# EasyEDA Pro project TC358870 HDMI2MIPI.epro, schematic Schematic2
Board Name: connector; Create Date: 2024-10-12; Page Name: P1; Project Name: tc358870 HDMI转MIPI; Schematic Name: Schematic2; Update Date: 2025-04-06; Company: 嘉立创EDA; Page Size: A3; Version: V1.0
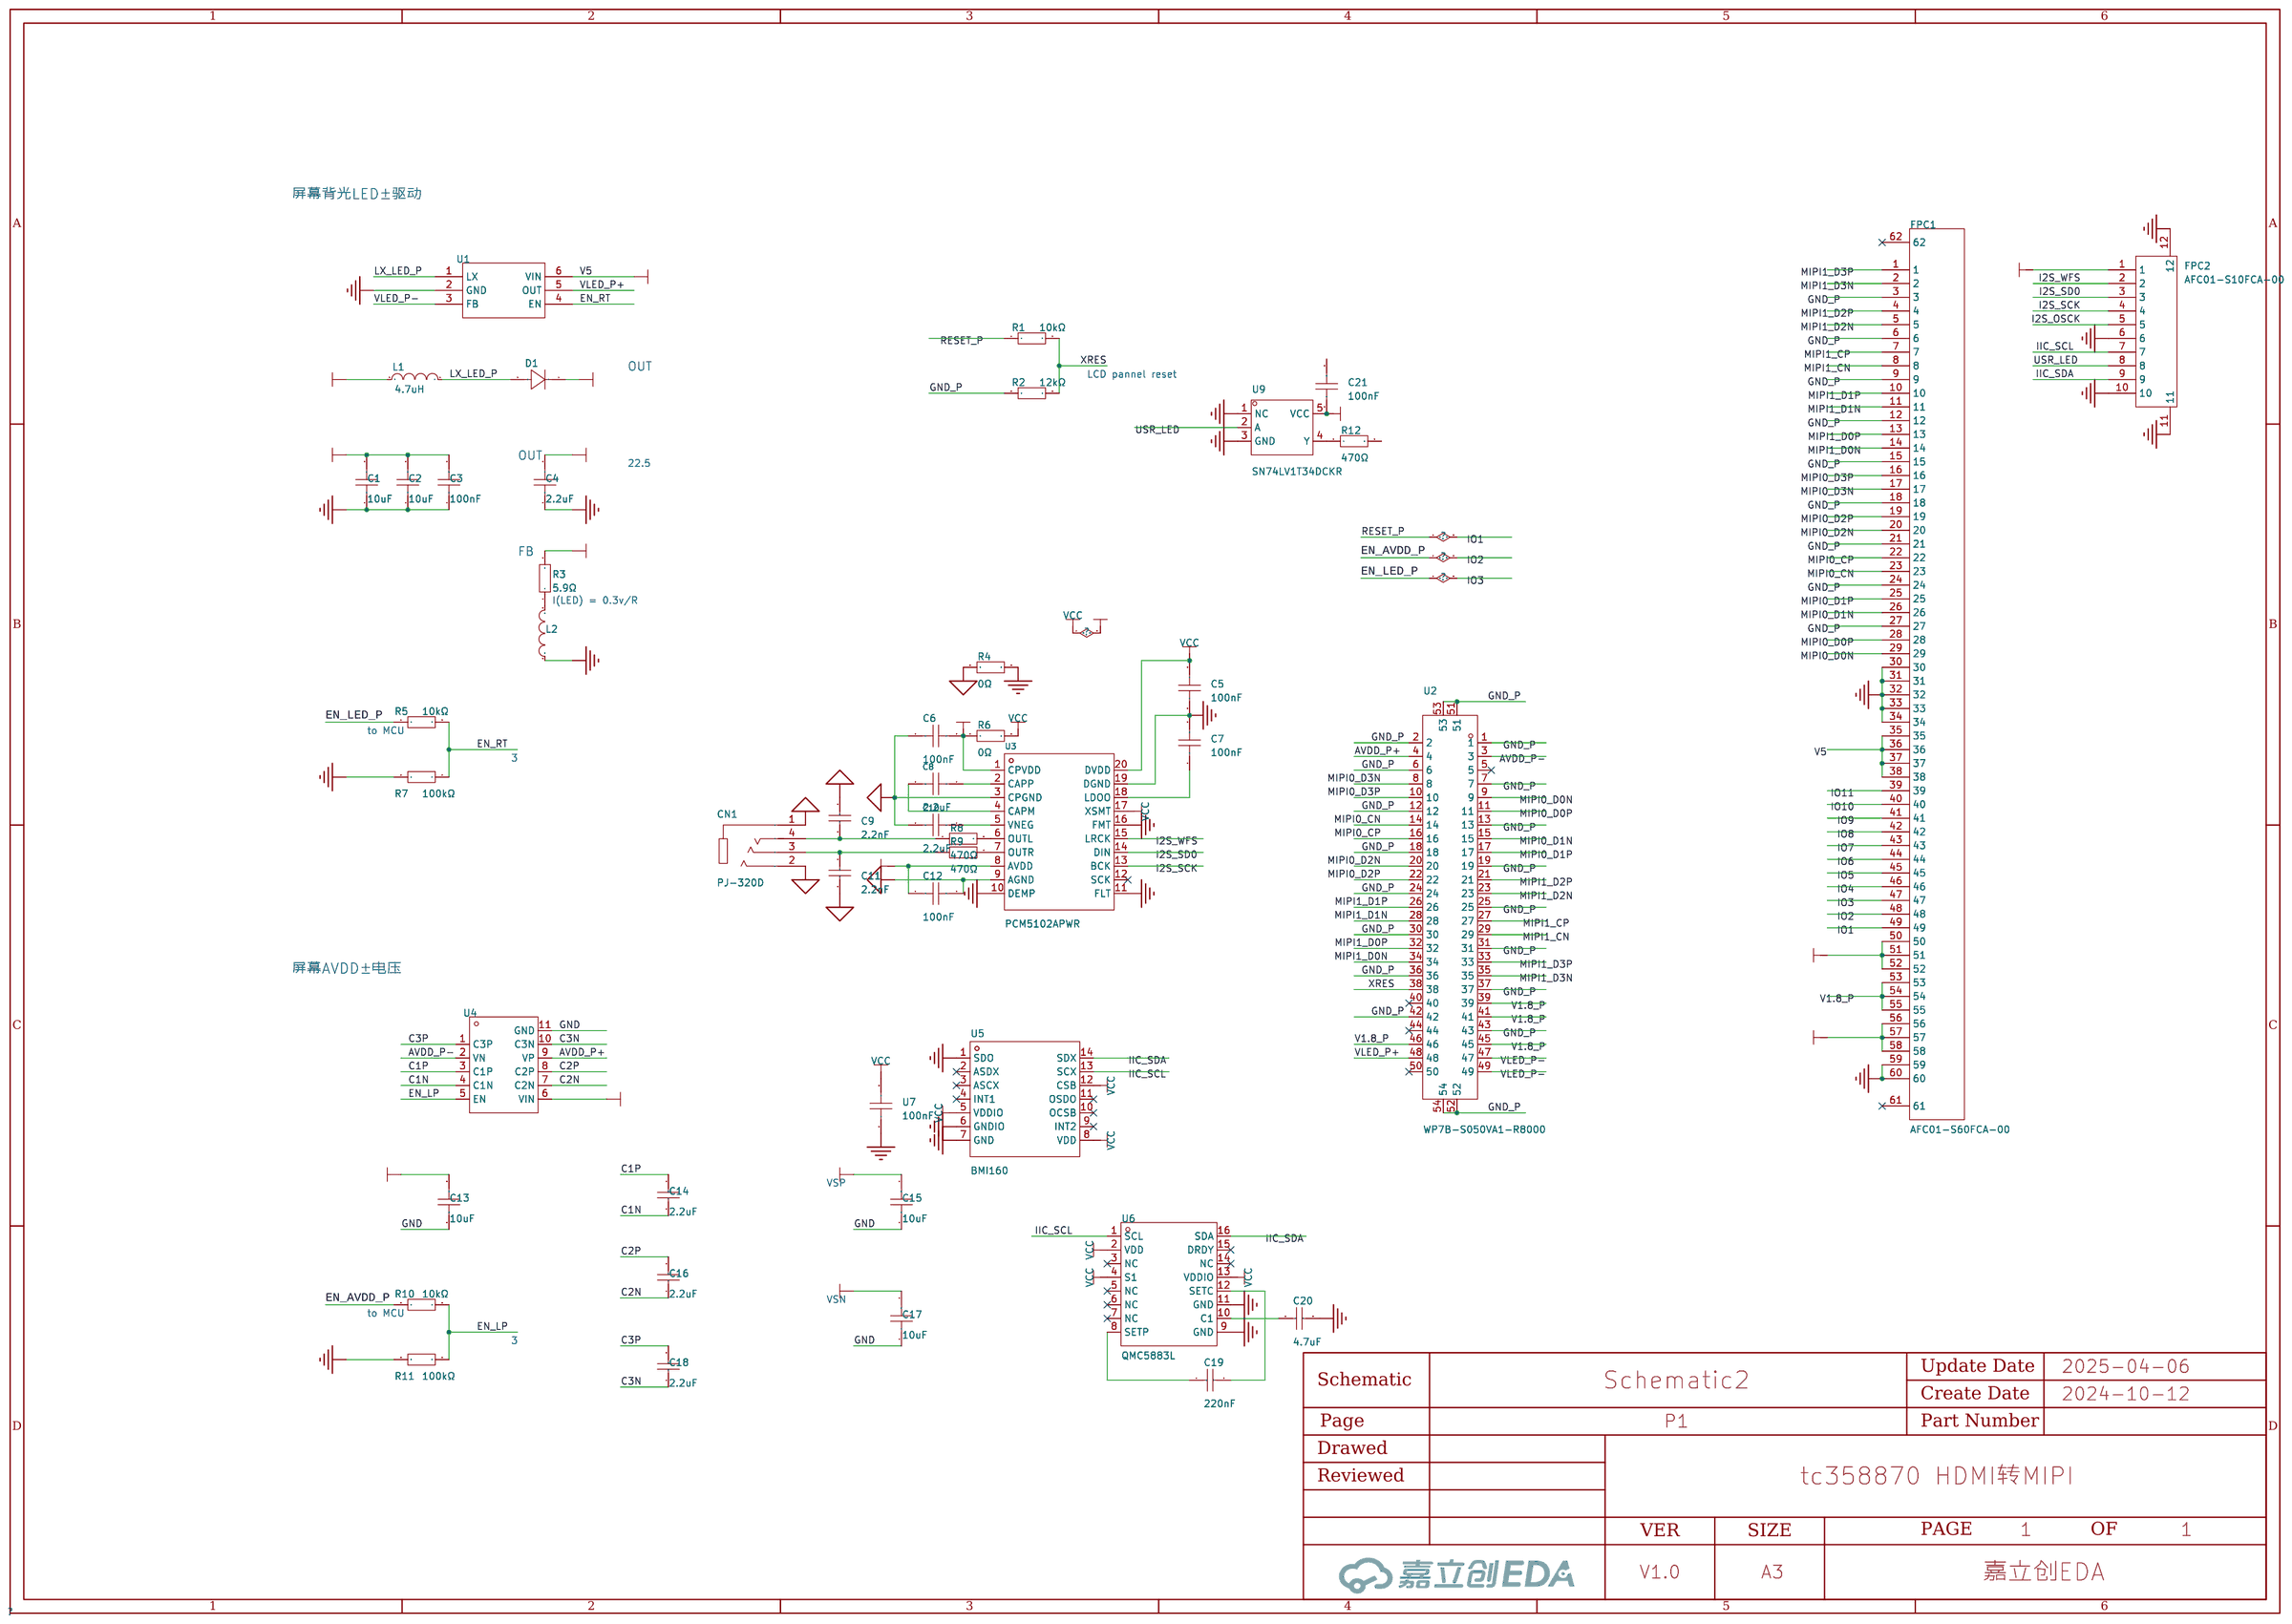
[diagram p1: schematic sheet]

## Parts
C1  10uF  [C0603]
C2  10uF  [C0603]
C3  100nF  [C0603]
C4  2.2uF  [C0603]
C5  100nF  [C0603]
C6  100nF  [C0603]
C7  100nF  [C0603]
C8  2.2uF  [C0603]
C9  2.2nF  [C0603]
C10  2.2uF  [C0603]
C11  2.2nF  [C0603]
C12  100nF  [C0603]
C13  10uF  [C0603]
C14  2.2uF  [C0603]
C15  10uF  [C0603]
C16  2.2uF  [C0603]
C17  10uF  [C0603]
C18  2.2uF  [C0603]
C19  220nF  [C0603]
C20  4.7uF  [C0603]
C21  100nF  [C0603]
CN1  PJ-320D  [AUDIO-SMD_PJ-320D]
D1  SS36FA  [SOD-123FL_L2.8-W1.8-LS3.6-RD]
FPC1  AFC01-S60FCA-00  [FPC-SMD_AFC01-S60FCC-00]
FPC2  AFC01-S10FCA-00  [FPC-SMD_P0.5-10P_FGS-XJ-H2.0]
L1  4.7uH  [IND-SMD_L4.4-W4.2]
L2  CBG201209U121T  [L0805]
R1  10kΩ  [R0603]
R2  12kΩ  [R0603]
R3  5.9Ω  [R0805]
R4  0Ω  [R0603]
R5  10kΩ  [R0603]
R6  0Ω  [R0603]
R7  100kΩ  [R0603]
R8  470Ω  [R0603]
R9  470Ω  [R0603]
R10  10kΩ  [R0603]
R11  100kΩ  [R0603]
R12  470Ω  [R0603]
U1  RT9293BGJ6  [SOT-23-6_L2.9-W1.6-P0.95-LS2.8-BR]
U2  WP7B-S050VA1-R8000  [CONN-SMD_WP7B-S050VA1-R8000]
U3  PCM5102APWR  [TSSOP-20_L6.5-W4.4-P0.65-LS6.4-BL]
U4  LP3102QVF  [TDFN-10_L3.0-W3.0-P0.50-BL-EP]
U5  BMI160  [LGA-14_L3.0-W2.5-P0.50-BL]
U6  QMC5883L  [LGA-16_L3.0-W3.0-P0.50-BL_SQ]
U7  100nF  [C0603]
U9  SN74LV1T34DCKR  [SC-70-5_L2.1-W1.3-P0.65-LS2.1-BR]

## Library data of the parts
C1 C2 C13 C15 C17 = CC0603MRX5R8BB106: 容值:10uF;精度:±20%;额定电压:25V;材质(温度系数):X5R;; LCSC Part Name: 10uF ±20% 25V; Supplier Part: C596327; Manufacturer: YAGEO(国巨); Supplier Footprint: 0603; JLCPCB Part Class: 扩展库; Datasheet: https://atta.szlcsc.com/upload/public/pdf/source/20200609/C596327_17DF31B1E9B32F0BAA34398C136F635E.pdf; Supplier: LCSC; Tolerance: ±20%; Voltage Rated: 25V; Temperature Coefficient: X5R
C3 C21 = CC0603KRX7R9BB104: 容值:100nF;精度:±10%;额定电压:50V;材质(温度系数):X7R;; LCSC Part Name: 100nF ±10% 50V; Supplier Part: C14663; Manufacturer: YAGEO(国巨); Supplier Footprint: 0603; JLCPCB Part Class: 基础库; Datasheet: https://atta.szlcsc.com/upload/public/pdf/source/20170116/1484561234239.pdf; Supplier: LCSC; Tolerance: ±10%; Voltage Rated: 50V; Temperature Coefficient: X7R
C4 C8 C10 = CL10A225KB8NNNC: 容值:2.2uF;精度:±10%;额定电压:50V;材质(温度系数):-;; LCSC Part Name: 2.2uF ±10% 50V; Supplier Part: C913904; Manufacturer: SAMSUNG(三星); Supplier Footprint: 0603; JLCPCB Part Class: 扩展库; Datasheet: https://atta.szlcsc.com/upload/public/pdf/source/20200102/C478861_C4302703595930F3C0E62DAD3349F1AA.pdf; Supplier: LCSC; Tolerance: ±10%; Voltage Rated: 50V
C5-C7 C12 U7 = CGA0603X7R104K500JT: 容值:100nF;精度:±10%;额定电压:50V;材质(温度系数):X7R;; LCSC Part Name: 100nF ±10% 50V; Supplier Part: C6119867; Manufacturer: HRE(芯声); Supplier Footprint: 0603; JLCPCB Part Class: 扩展库; Supplier: LCSC; Tolerance: ±10%; Voltage Rated: 50V; Temperature Coefficient: X7R
C9 C11 = 0603B222K500NT: 容值:2.2nF;精度:±10%;额定电压:50V;材质(温度系数):X7R;; LCSC Part Name: 2.2nF ±10% 50V; Supplier Part: C1604; Manufacturer: FH(风华); Supplier Footprint: 0603; JLCPCB Part Class: 基础库; Datasheet: https://atta.szlcsc.com/upload/public/pdf/source/20200305/C486355_26A10D38EF8C2A5C37091D0039909270.pdf; Supplier: LCSC; Tolerance: ±10%; Voltage Rated: 50V; Temperature Coefficient: X7R
C14 C16 C18 = CL10A225KO8NNNC: 容值:2.2uF;精度:±10%;额定电压:16V;材质(温度系数):X5R;; LCSC Part Name: 2.2uF ±10% 16V; Supplier Part: C23630; Manufacturer: SAMSUNG(三星); Supplier Footprint: 0603; JLCPCB Part Class: 基础库; Datasheet: https://atta.szlcsc.com/upload/public/pdf/source/20160103/1457707709512.pdf; Supplier: LCSC; Tolerance: ±10%; Voltage Rated: 16V; Temperature Coefficient: X5R
C19 = CL10B224KA8NNNC: 容值:220nF;精度:±10%;额定电压:25V;材质(温度系数):X7R;; LCSC Part Name: 220nF ±10% 25V; Supplier Part: C21120; Manufacturer: SAMSUNG(三星); Supplier Footprint: 0603; JLCPCB Part Class: 基础库; Datasheet: https://atta.szlcsc.com/upload/public/pdf/source/20160218/1457707763339.pdf; Supplier: LCSC; Tolerance: ±10%; Voltage Rated: 25V; Temperature Coefficient: X7R
C20 = CL10A475KO8NNNC: 容值:4.7uF;精度:±10%;额定电压:16V;材质(温度系数):X5R;; LCSC Part Name: 4.7uF ±10% 16V; Supplier Part: C19666; Manufacturer: SAMSUNG(三星); Supplier Footprint: 0603; JLCPCB Part Class: 基础库; Datasheet: https://atta.szlcsc.com/upload/public/pdf/source/20160218/1457707763339.pdf; Supplier: LCSC; Tolerance: ±10%; Voltage Rated: 16V; Temperature Coefficient: X5R
CN1 = PJ-320D_C431535: 连接器类型:3.5mm耳机座;额定电流:300mA;额定电压:50V;工作温度范围:-16℃~+65℃;; LCSC Part Name: 3.5mm耳机座; Supplier Part: C431535; Manufacturer: SHOU HAN(首韩); Supplier Footprint: SMD; JLCPCB Part Class: 扩展库; Datasheet: https://atta.szlcsc.com/upload/public/pdf/source/20190925/C431535_8B274506621F6117FB020BF07A197848.pdf; Supplier: LCSC; Connector Type: 3.5mm耳机座; Current Rating (Max): 300mA; Voltage Rating (Max): 50V; Operating Temperature Range: -16℃~+65℃
D1 = SS36FA: 二极管配置:独立式;直流反向耐压(Vr):60V;平均整流电流(Io):3A;正向压降(Vf):750mV@3A;反向电流(Ir):500uA@60V;; LCSC Part Name: 3 A、60 V 表面贴装肖特基势垒整流器; Supplier Part: C719835; Manufacturer: onsemi(安森美); Supplier Footprint: SOD-123FL; JLCPCB Part Class: 扩展库; Datasheet: https://atta.szlcsc.com/upload/public/pdf/source/20200807/C719828_012175D3E2CDD5FCD772096ACDE7B286.pdf; Supplier: LCSC; Diode Configuration: 独立式; Reverse Voltage (Vr): 60V; Average Rectified Current (Io): 3A; Forward Voltage (Vf@If): 750mV@3A; Reverse Leakage Current (Ir): 500uA@60V
FPC1 = AFC01-S60FCA-00: 锁定特性:翻盖式;触点类型:下接;触点数量:60P;间距:0.5mm;安装类型:卧贴;; LCSC Part Name: 间距:0.5mm P数:60P 翻盖式 下接; Supplier Part: C262678; Manufacturer: JS(钜硕电子); Supplier Footprint: SMD,P=0.5mm,卧贴; JLCPCB Part Class: 扩展库; Datasheet: https://atta.szlcsc.com/upload/public/pdf/source/20190726/C11047_78689421E6D6672DE8D11ECCF89B3729.pdf; Supplier: LCSC; Locking Feature: 翻盖式; Contact Type: 下接; Number of Contacts: 60P; Pitch: 0.5mm; Mounting Type: 卧贴; FFC, FCB Thickness: 0.3mm; Height Above Board: 2mm
FPC2 = AFC01-S10FCA-00: 锁定特性:翻盖式;触点类型:下接;触点数量:10P;间距:0.5mm;安装类型:卧贴;; LCSC Part Name: 间距:0.5mm P数:10P 翻盖式 下接; Supplier Part: C262659; Manufacturer: JS(钜硕电子); Supplier Footprint: SMD,P=0.5mm,卧贴; JLCPCB Part Class: 扩展库; Datasheet: https://atta.szlcsc.com/upload/public/pdf/source/20190816/C413942_2A72D1AC756EAE17EEDF756A339D4500.pdf; Supplier: LCSC; Locking Feature: 翻盖式; Contact Type: 下接; Number of Contacts: 10P; Pitch: 0.5mm; Mounting Type: 卧贴; FFC, FCB Thickness: 0.3mm; Height Above Board: 2mm
L1 = cjiang国产功率电感-4.7uH ±20% 3A 105mΩ: 电感值:4.7uH;精度:±20%;额定电流:3A;饱和电流(Isat):3A;直流电阻(DCR):105mΩ;; LCSC Part Name: 4.7uH ±20% 3A 105mΩ; Supplier Part: C3040385; Manufacturer: cjiang(长江微电); Manufacturer Part: FAUL0420-4R7MT; Supplier Footprint: SMD,4.4x4.2x1.8mm; JLCPCB Part Class: Extended Part; Datasheet: https://item.szlcsc.com/3597562.html; Supplier: LCSC; Tolerance: ±20%; Rated Current: 3A; Saturation Current (Isat): 3A; DC Resistance (DCR): 105mΩ
L2 = CBG201209U121T: 标称阻抗@测试频率:120Ω@100MHz;误差:±25%;直流电阻(RDC):200mΩ;额定电流:500mA;电路数:1;; LCSC Part Name: 120Ω@100MHz ±25%; Supplier Part: C41330; Manufacturer: FH(风华); Supplier Footprint: 0805; JLCPCB Part Class: 扩展库; Datasheet: https://atta.szlcsc.com/upload/public/pdf/source/20150124/1457707261288.pdf; Supplier: LCSC; Impedance @ Frequency: 120Ω@100MHz; Tolerance: ±25%; DC Resistance: 200mΩ; Current Rating: 500mA; Circuits: 1
R1 R5 R10 = 0603WAF1002T5E: 电阻类型:厚膜电阻;阻值:10kΩ;精度:±1%;功率:100mW;温度系数:±100ppm/℃;最大工作电压:75V;工作温度范围:-55℃~+155℃;; LCSC Part Name: 10kΩ ±1% 100mW; Supplier Part: C25804; Manufacturer: UNI-ROYAL(厚声); Supplier Footprint: 0603; JLCPCB Part Class: 基础库; Datasheet: https://atta.szlcsc.com/upload/public/pdf/source/20200306/C422600_1E6D84923E4A46A82E41ADD87F860B5C.pdf; Supplier: LCSC; Type: 厚膜电阻; Tolerance: ±1%; Power(Watts): 100mW; Temperature Coefficient: ±100ppm/℃; Overload Voltage (Max): 75V; Operating Temperature Range: -55℃~+155℃
R2 = 0603WAF1202T5E: 电阻类型:厚膜电阻;阻值:12kΩ;精度:±1%;功率:100mW;; LCSC Part Name: 12kΩ ±1% 100mW; Supplier Part: C22790; Manufacturer: UNI-ROYAL(厚声); Supplier Footprint: 0603; JLCPCB Part Class: Basic Part; Datasheet: https://atta.szlcsc.com/upload/public/pdf/source/20200306/C422600_1E6D84923E4A46A82E41ADD87F860B5C.pdf; Supplier: LCSC; Type: 厚膜电阻; Tolerance: ±1%; Power(Watts): 100mW; Temperature Coefficient: ±100ppm/℃; Overload Voltage (Max): 75V; Operating Temperature Range: -55℃~+155℃
R3 = AA0805FR-075R9L: 电阻类型:厚膜电阻;阻值:5.9Ω;精度:±1%;功率:500mW;; LCSC Part Name: 5.9Ω ±1% 500mW; Supplier Part: C723461; Manufacturer: YAGEO(国巨); Supplier Footprint: 0805; JLCPCB Part Class: Extended Part; Datasheet: https://atta.szlcsc.com/upload/public/pdf/source/20200817/C723461_F5BC0DBBD809D386421B590DB17D1515.pdf; Supplier: LCSC; Type: 厚膜电阻; Tolerance: ±1%; Power(Watts): 500mW; Temperature Coefficient: ±200ppm/℃; Overload Voltage (Max): 200V; Operating Temperature Range: -55℃~+155℃
R4 R6 = 0603WAF0000T5E: 电阻类型:厚膜电阻;阻值:0Ω;精度:±1%;功率:100mW;最大工作电压:75V;工作温度范围:-55℃~+155℃;; LCSC Part Name: 0Ω ±1% 100mW; Supplier Part: C21189; Manufacturer: UNI-ROYAL(厚声); Supplier Footprint: 0603; JLCPCB Part Class: Basic Part; Datasheet: https://atta.szlcsc.com/upload/public/pdf/source/20200306/C422600_1E6D84923E4A46A82E41ADD87F860B5C.pdf; Supplier: LCSC; Type: 厚膜电阻; Tolerance: ±1%; Power(Watts): 100mW; Overload Voltage (Max): 75V; Operating Temperature Range: -55℃~+155℃
R7 R11 = 0603WAF1003T5E: 电阻类型:厚膜电阻;阻值:100kΩ;精度:±1%;功率:100mW;温度系数:±100ppm/℃;最大工作电压:75V;工作温度范围:-55℃~+155℃;; LCSC Part Name: 100kΩ ±1% 100mW; Supplier Part: C25803; Manufacturer: UNI-ROYAL(厚声); Supplier Footprint: 0603; JLCPCB Part Class: 基础库; Datasheet: https://atta.szlcsc.com/upload/public/pdf/source/20200306/C422600_1E6D84923E4A46A82E41ADD87F860B5C.pdf; Supplier: LCSC; Type: 厚膜电阻; Tolerance: ±1%; Power(Watts): 100mW; Temperature Coefficient: ±100ppm/℃; Overload Voltage (Max): 75V; Operating Temperature Range: -55℃~+155℃
R8 R9 R12 = 0603WAF4700T5E: 电阻类型:厚膜电阻;阻值:470Ω;精度:±1%;功率:100mW;最大工作电压:75V;温度系数:±100ppm/℃;; LCSC Part Name: 470Ω ±1% 100mW 厚膜电阻; Supplier Part: C23179; Manufacturer: UNI-ROYAL(厚声); Supplier Footprint: 0603; JLCPCB Part Class: 基础库; Datasheet: https://atta.szlcsc.com/upload/public/pdf/source/20200306/C422600_1E6D84923E4A46A82E41ADD87F860B5C.pdf; Supplier: LCSC; Type: 厚膜电阻; Tolerance: ±1%; Power(Watts): 100mW; Overload Voltage (Max): 75V; Temperature Coefficient: ±100ppm/℃; Operating Temperature Range: -55℃~+155℃
U1 = RT9293BGJ6: 小包装、高性能，异步升压的WLED驱动器; Supplier Part: C36462; Manufacturer: RICHTEK(立锜); Supplier Footprint: SOT-23-6; JLCPCB Part Class: 扩展库; Datasheet: https://atta.szlcsc.com/upload/public/pdf/source/20140924/1457707240143.pdf; Supplier: LCSC
U2 = WP7B-S050VA1-R8000_1: PIN总数:-;间距:0.4mm;安装方式:立贴;行数:2;; LCSC Part Name: 间距:0.4mm 母 立贴; Supplier Part: C3652895; Manufacturer: JAE(日本航空电子); Supplier Footprint: SMD,P=0.4mm; JLCPCB Part Class: 扩展库; Supplier: LCSC; Pitch: 0.4mm; Mounting Style: 立贴; Number of Rows: 2; Contact Plating: 金
U3 = PCM5102APWR: 接口类型:PCM;供电电压:1.65V~3.46V;分辨率(位):24；16；32;; Supplier Part: C107671; Manufacturer: TI(德州仪器); Supplier Footprint: TSSOP-20; JLCPCB Part Class: 扩展库; Datasheet: https://www.ti.com/cn/lit/gpn/pcm5102a; Supplier: LCSC; Interface Type: PCM; Supply Voltage: 1.65V~3.46V; Number of Channels: 2; Resolution: 24；16；32; Operating Temperature: -25℃~+85℃
U4 = LP3102QVF: Supplier Part: C517005; Manufacturer: LOWPOWER(微源半导体); Supplier Footprint: TDFN-10-EP(3x3); JLCPCB Part Class: 扩展库; Datasheet: https://atta.szlcsc.com/upload/public/pdf/source/20200421/C517005_603C0DEA482298D49C4A683B370EB739.pdf; Supplier: LCSC
U5 = BMI160: 传感器类型:-;轴向:-;接口类型:-;; Supplier Part: C94021; Manufacturer: Bosch(博世); Supplier Footprint: LGA-14(2.5x3); JLCPCB Part Class: 扩展库; Datasheet: https://atta.szlcsc.com/upload/public/pdf/source/20170818/C94021_1503051343757895423.pdf; Supplier: LCSC; Operating Temperature: -40℃~+85℃
U6 = QMC5883L: LCSC Part Name: 三轴磁传感器; Supplier Part: C976032; Manufacturer: QST(上海矽睿); Supplier Footprint: LGA-16(3x3); JLCPCB Part Class: 扩展库; Datasheet: https://atta.szlcsc.com/upload/public/pdf/source/20201217/C976032_5B9A2F3901E175046CBA037B1F18A1F2.pdf; Supplier: LCSC
U9 = SN74LV1T34DCKR: 输入类型:-;电源电压:1.6V~5.5V;元件数:1;每个元件位数:1;灌电流(IOL):8mA;拉电流(IOH):8mA;; Supplier Part: C78541; Manufacturer: TI(德州仪器); Supplier Footprint: SC-70-5; JLCPCB Part Class: 扩展库; Datasheet: https://www.ti.com/cn/lit/gpn/sn74lv1t34; Supplier: LCSC; output type: 推挽; Supply Voltage: 1.6V~5.5V; Number of Elements: 1; Number of Bits per Element: 1; Sink Current: 8mA; Source Current: 8mA; Logic Family: 74LV; Operating Temperature: -40℃~+125℃

## Nets
AGND: C6.1 C9.2 C10.2 C11.1 C12.2 CN1.1 CN1.2 R4.1 U3.3(CPGND) U3.9(AGND)
AVCC: C6.2 C12.1 R6.1 U3.1(CPVDD) U3.8(AVDD)
AVDD_P+: C15.2 U2.4 U4.9(VP)
AVDD_P-: C17.2 U2.3 U4.2(VN)
GND: C1.1 C2.1 C3.1 C4.1 C5.1 C7.2 C13.1 C15.1 C17.1 C20.2 FPC1.30 FPC1.31 FPC1.32 FPC1.33 FPC1.34 FPC1.59 FPC1.60 FPC2.6 FPC2.10 FPC2.11 FPC2.12 L2.1 R4.2 R7.2 R11.2 U1.2(GND) U3.10(DEMP) U3.11(FLT) U3.16(FMT) U3.19(DGND) U4.11(GND) U5.1(SDO) U5.6(GNDIO) U5.7(GND) U6.9(GND) U6.11(GND) U7.1 U9.1(NC) U9.3(GND)
GND_P: FPC1.3 FPC1.6 FPC1.9 FPC1.12 FPC1.15 FPC1.18 FPC1.21 FPC1.24 FPC1.27 R2.1 U2.1 U2.2 U2.6 U2.7 U2.12 U2.13 U2.18 U2.19 U2.24 U2.25 U2.30 U2.31 U2.36 U2.37 U2.42 U2.43 U2.51 U2.52 U2.53 U2.54
V1.1: FPC1.56 FPC1.57 FPC1.58
V1.8_P: FPC1.53 FPC1.54 FPC1.55 U2.39 U2.41 U2.45 U2.46
V3.3: C5.2 C13.2 FPC1.50 FPC1.51 FPC1.52 FPC2.1 R6.2 U3.17(XSMT) U3.20(DVDD) U4.6(VIN) U5.5(VDDIO) U5.8(VDD) U5.12(CSB) U6.2(VDD) U6.4(S1) U6.13(VDDIO) U7.2
V5: C1.2 C2.2 C3.2 C21.1 FPC1.35 FPC1.36 FPC1.37 FPC1.38 L1.2 U1.6(VIN) U9.5(VCC)
C1N: C14.1 U4.4(C1N)
C1P: C14.2 U4.3(C1P)
C2N: C16.1 U4.7(C2N)
C2P: C16.2 U4.8(C2P)
C3N: C18.1 U4.10(C3N)
C3P: C18.2 U4.1(C3P)
EN_AVDD_P: FPC1.48 R10.1
EN_LED_P: FPC1.47 R5.1
EN_LP: R10.2 R11.1 U4.5(EN)
EN_RT: R5.2 R7.1 U1.4(EN)
I2S_OSCK: FPC2.5
I2S_SCK: FPC2.4 U3.13(BCK)
I2S_SD0: FPC2.3 U3.14(DIN)
I2S_WFS: FPC2.2 U3.15(LRCK)
IIC_SCL: FPC2.7 U5.13(SCX) U6.1(SCL)
IIC_SDA: FPC2.9 U5.14(SDX) U6.16(SDA)
IO1: FPC1.49 R1.1
IO4: FPC1.46
IO5: FPC1.45
IO6: FPC1.44
IO7: FPC1.43
IO8: FPC1.42
IO9: FPC1.41
IO10: FPC1.40
IO11: FPC1.39
LX_LED_P: D1.2(A) L1.1 U1.1(LX)
MIPI0_CN: FPC1.23 U2.14
MIPI0_CP: FPC1.22 U2.16
MIPI0_D0N: FPC1.29 U2.9
MIPI0_D0P: FPC1.28 U2.11
MIPI0_D1N: FPC1.26 U2.15
MIPI0_D1P: FPC1.25 U2.17
MIPI0_D2N: FPC1.20 U2.20
MIPI0_D2P: FPC1.19 U2.22
MIPI0_D3N: FPC1.17 U2.8
MIPI0_D3P: FPC1.16 U2.10
MIPI1_CN: FPC1.8 U2.29
MIPI1_CP: FPC1.7 U2.27
MIPI1_D0N: FPC1.14 U2.34
MIPI1_D0P: FPC1.13 U2.32
MIPI1_D1N: FPC1.11 U2.28
MIPI1_D1P: FPC1.10 U2.26
MIPI1_D2N: FPC1.5 U2.23
MIPI1_D2P: FPC1.4 U2.21
MIPI1_D3N: FPC1.2 U2.35
MIPI1_D3P: FPC1.1 U2.33
USR_LED: FPC2.8 U9.2(A)
VLED_P+: C4.2 D1.1(K) U1.5(OUT) U2.48
VLED_P-: R3.2 U1.3(FB) U2.47 U2.49
XRES: R1.2 R2.2 U2.38
$1N1024: L2.2 R3.1
$1N5793: C7.1 U3.18(LDOO)
$1N5795: C8.2 U3.4(CAPM)
$1N5796: C10.1 U3.5(VNEG)
$1N5798: C8.1 U3.2(CAPP)
$1N5805: R8.2 U3.6(OUTL)
$1N5806: R9.2 U3.7(OUTR)
$1N5807: C9.1 CN1.4 R8.1
$1N5808: C11.2 CN1.3 R9.1
$1N9328: C19.2 U6.12(SETC)
$1N9337: C19.1 U6.8(SETP)
$1N9463: C20.1 U6.10(C1)
$1N16105: R12.1 U9.4(Y)

Not connected (* = marked no-connect by the designer): C21 2; FPC1 61* 62*; R12 2; U2 5* 40* 44* 50*; U3 12(SCK)*; U5 2(ASDX)* 3(ASCX)* 4(INT1)* 9(INT2)* 10(OCSB)* 11(OSDO)*; U6 3(NC)* 5(NC)* 6(NC)* 7(NC)* 14(NC)* 15(DRDY)*

## Notes on the sheet
- 屏幕背光LED±驱动
- OUT
- LCD pannel reset
- OUT
- 22.5
- FB
- I(LED) = 0.3v/R
- to MCU
- 3
- 屏幕AVDD±电压
- VSP
- VSN
- to MCU
- 3
